# Altium project 28Pins_Project_V1I1.PrjPcb (part 1 of 2)
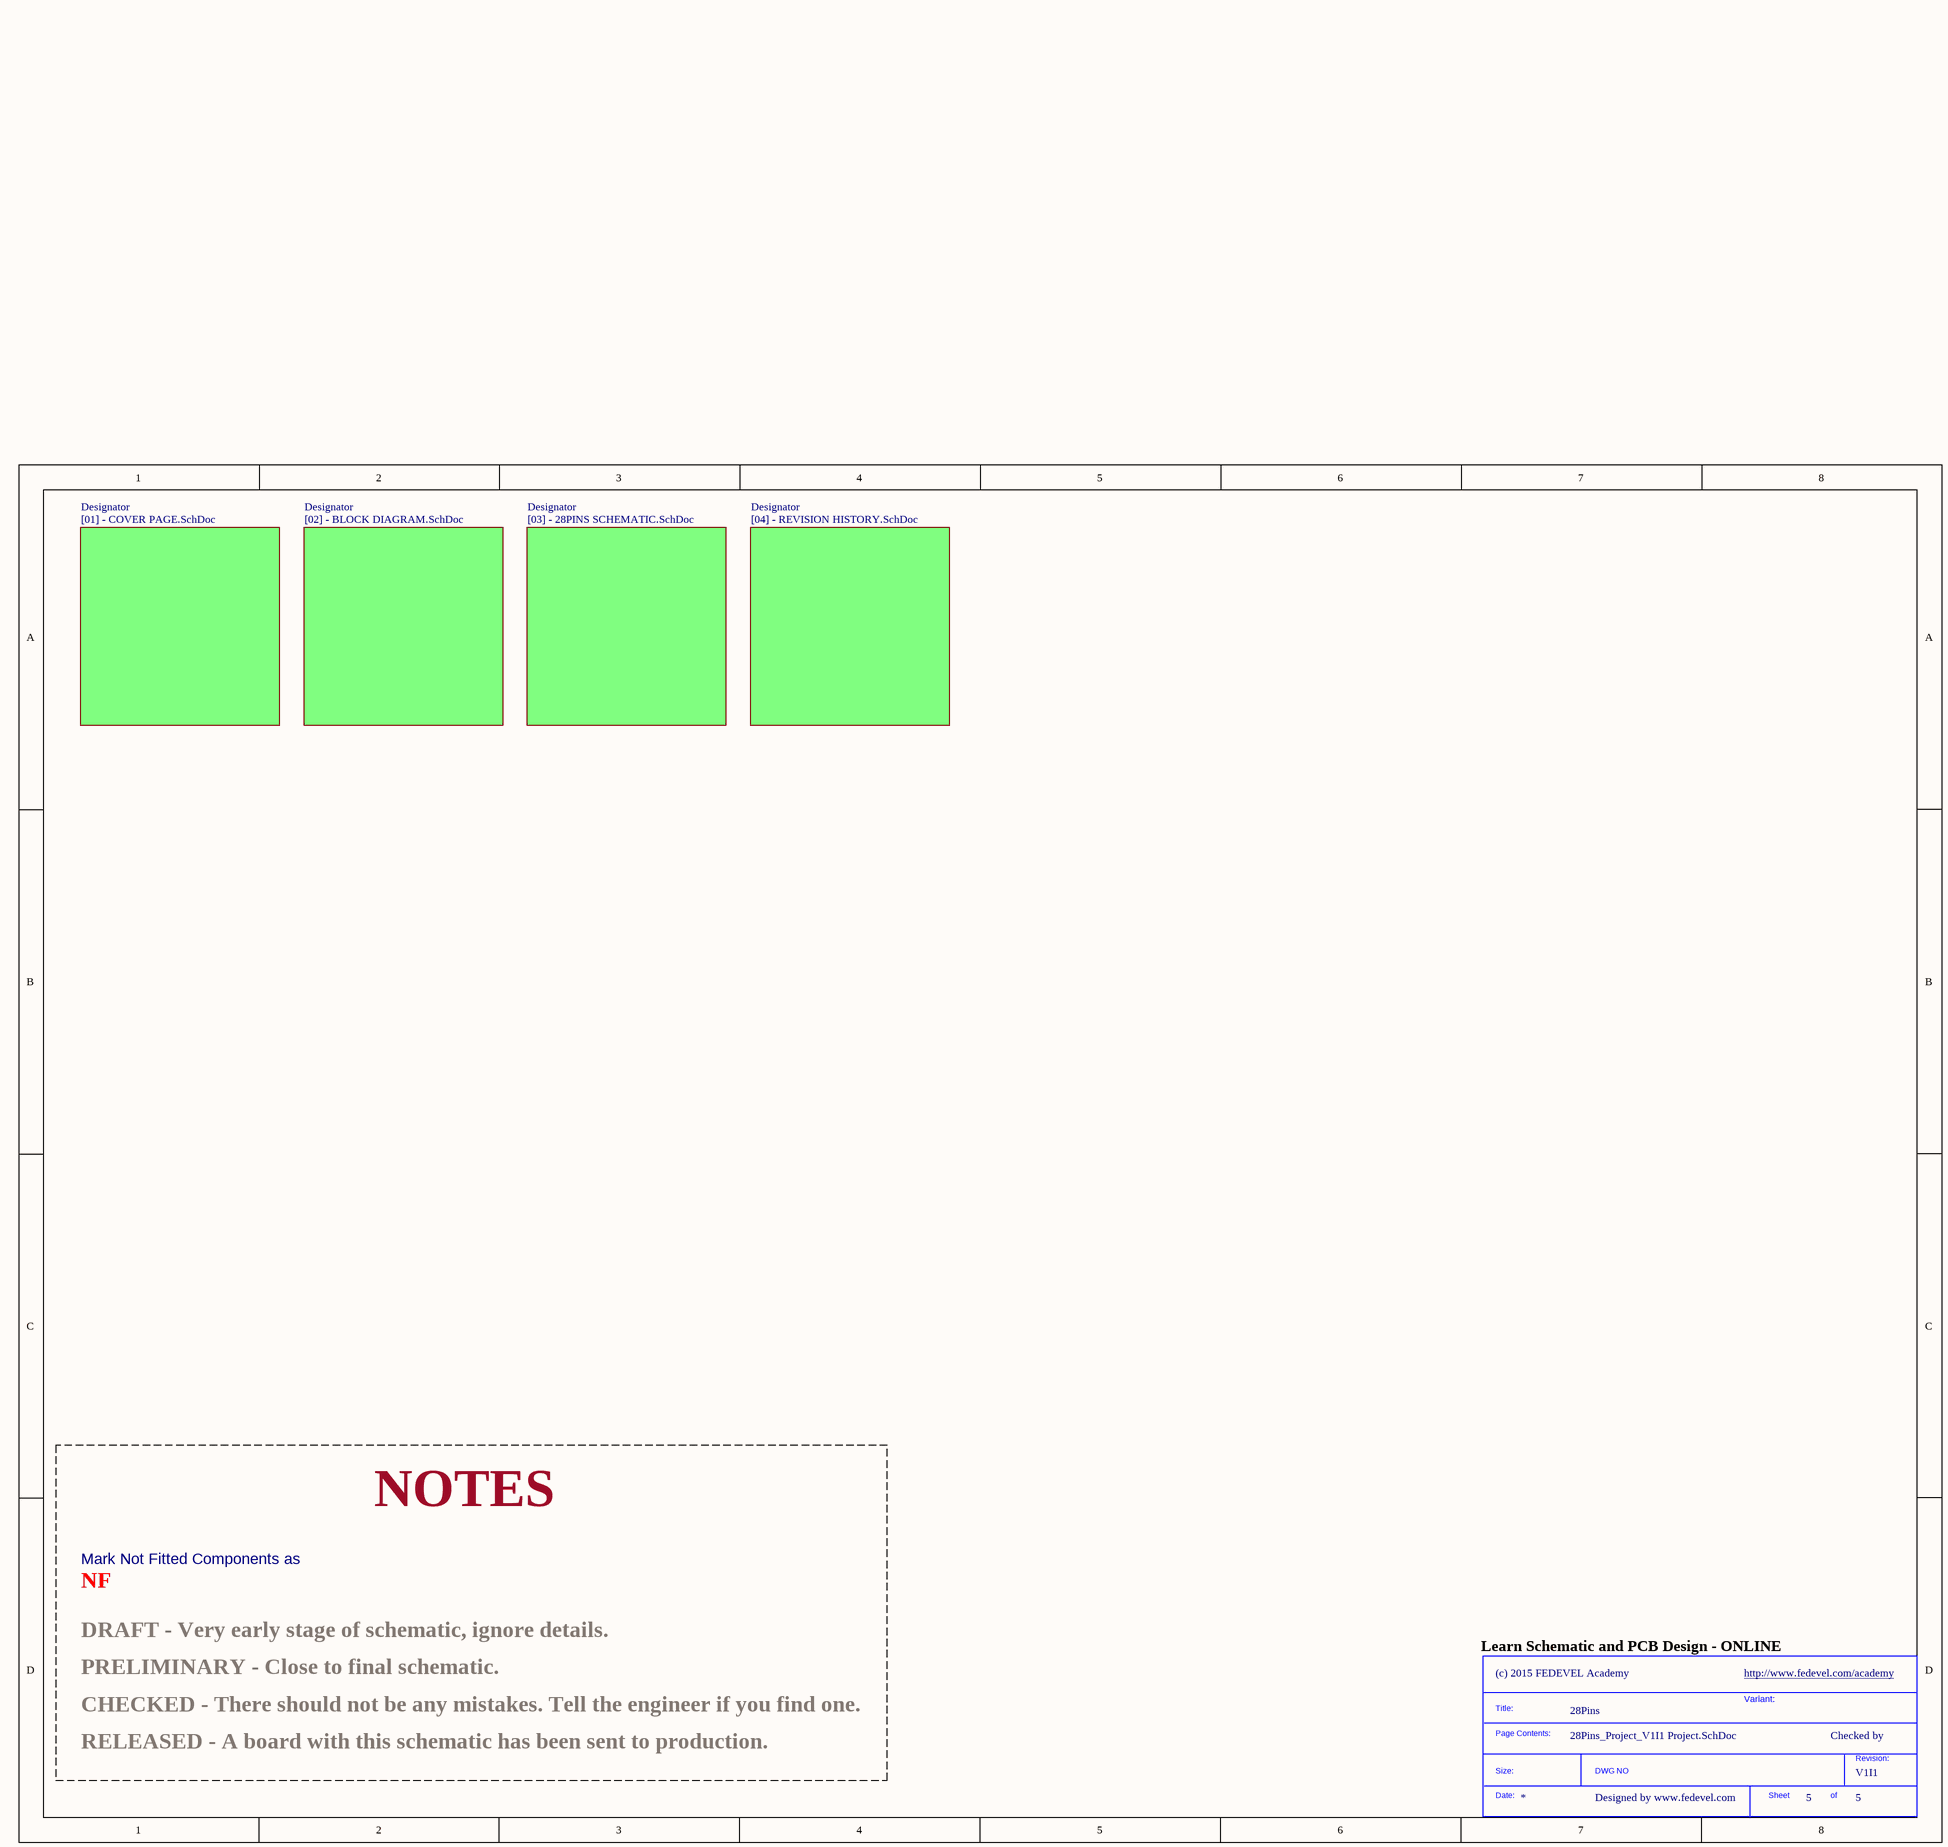
[diagram p0: 28Pins_Project_V1I1 Project.SchDoc]
VersionRevision: V1I1; Project: 28Pins; NotFitted: NF; Company: (c) 2015 FEDEVEL Academy; ClientWebsite: www.fedevel.com; ClientContactName: Robert Feranec; ClientContactEmail: robert.feranec@fedevel.com; ClientCompanyName: FEDEVEL Academy
5 sheets, 114 parts. Net scope: global (net labels, ports and power ports of the same name join across sheets).
Board file: 28Pins_Project_V1I1_PCB.PcbDoc
Sheets:
  28Pins_Project_V1I1 Project.SchDoc
    Designator = [01] - COVER PAGE.SchDoc
    Designator = [02] - BLOCK DIAGRAM.SchDoc
    Designator = [04] - REVISION HISTORY.SchDoc
    Designator = [03] - 28PINS SCHEMATIC.SchDoc

## Sheet 28Pins_Project_V1I1 Project.SchDoc
size A3; DocumentNumber: 5; SheetNumber: 5; SheetTotal: 5; PageSetup: Record=PageOptions|CenterHorizontal=True|CenterVertical=True|PrintScale=1.07|XCorrection=1.00|YCorrection=1.00|PrintKind=1|BorderSize=5000000|LeftOffset=0|BottomOffset=0|Orientation=2|PaperLength=1000|PaperWidth=1000|Scale=100|PaperSource=7|PrintQuality=600|MediaType=1|DitherType=10|PaperKind=A3|PrintScaleMode=1

### Parts
(Parts that share a designator on the sheet are numbered #1, #2 ... from top to bottom, then left to right.)
*#1  SDTitleBlock  (value not drawn)  (graphical)

### Sub-sheets
Designator = [01] - COVER PAGE.SchDoc: no entries
Designator = [02] - BLOCK DIAGRAM.SchDoc: no entries
Designator = [04] - REVISION HISTORY.SchDoc: no entries
Designator = [03] - 28PINS SCHEMATIC.SchDoc: no entries

### Notes on the sheet
- NOTES
- NF
- Mark Not Fitted Components as
- PRELIMINARY - Close to final schematic.
- DRAFT - Very early stage of schematic, ignore details.
- (near *#1) Learn Schematic and PCB Design - ONLINE
- http://www.fedevel.com/academy
- CHECKED - There should not be any mistakes. Tell the engineer if you find one.
- Variant:
- Checked by
- RELEASED - A board with this schematic has been sent to production.
- Designed by www.fedevel.com
- (in symbol SDTitleBlock) Title:; Page Contents:; Revision:; Size:; DWG NO; Date:; Sheet; of

## Sheet [01] - COVER PAGE.SchDoc
size A3; DocumentNumber: 1; SheetNumber: 1; SheetTotal: 5
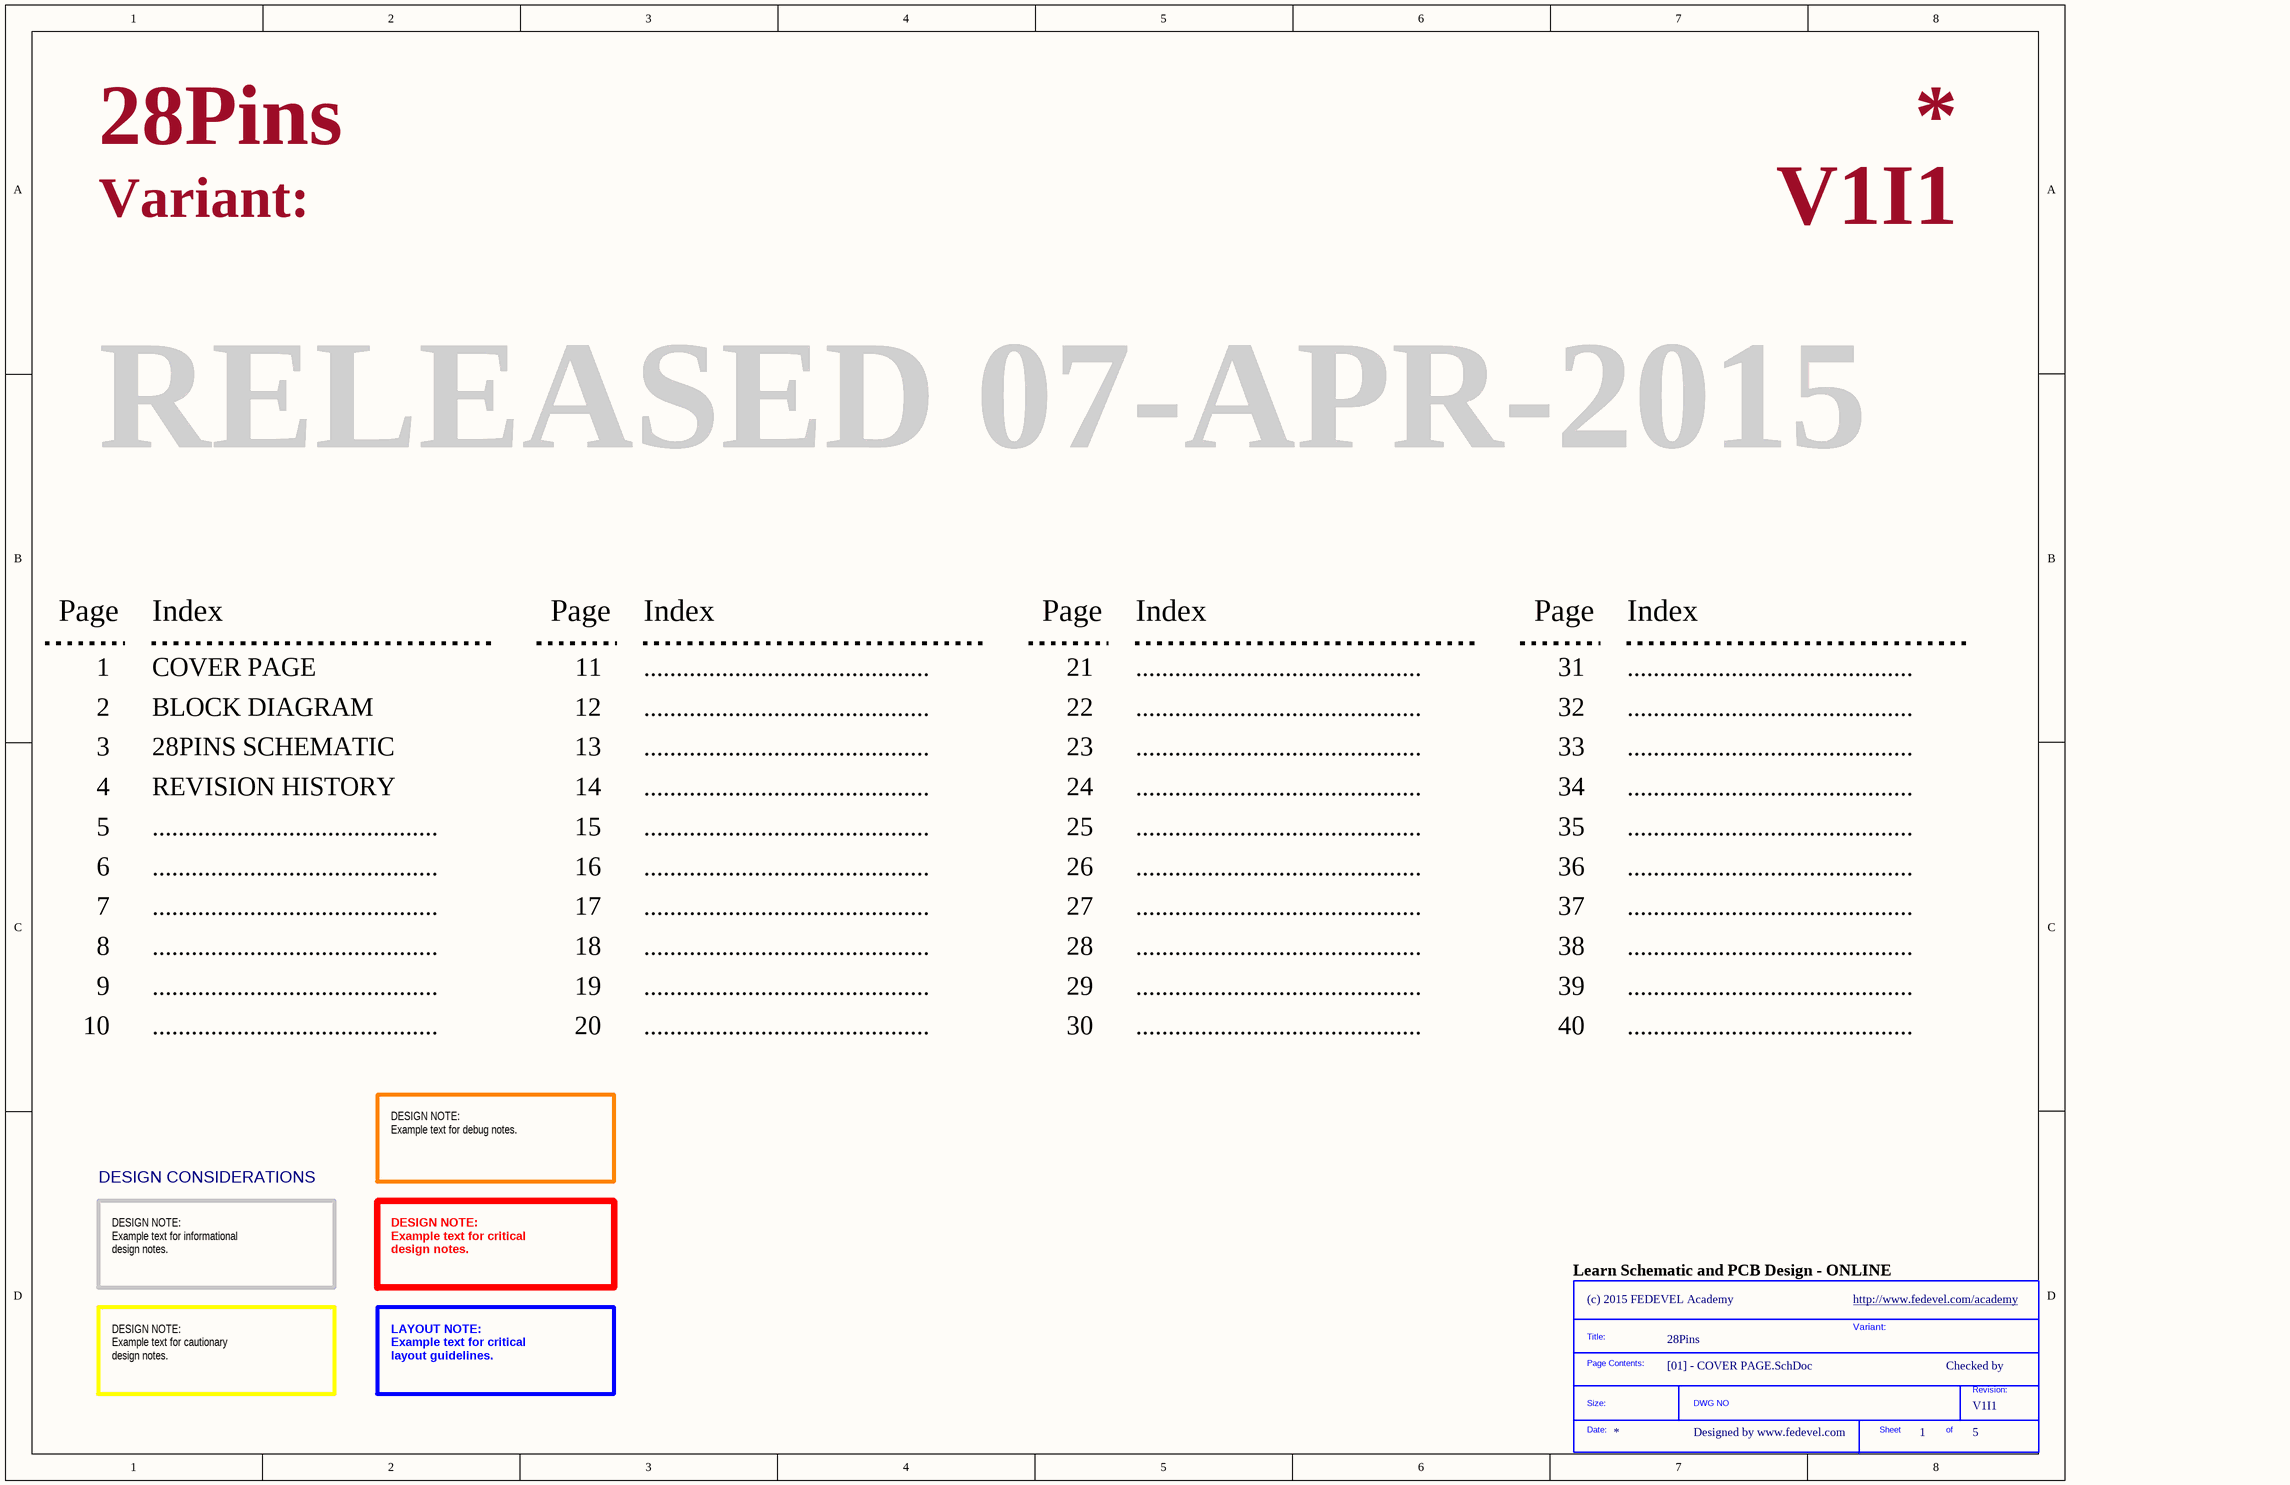
[diagram p1: [01] - COVER PAGE.SchDoc]

### Parts
(Parts that share a designator on the sheet are numbered #1, #2 ... from top to bottom, then left to right.)
*#2  SDTitleBlock  (value not drawn)  (graphical)

### Notes on the sheet
- Variant:
- RELEASED 07-APR-2015
- Page
- Index
- 1
- COVER PAGE
- 11
- ............................................
- 21
- 31
- 2
- 3
- BLOCK DIAGRAM
- 28PINS SCHEMATIC
- 12
- 13
- 22
- 23
- 32
- 33
- 4
- 5
- REVISION HISTORY
- 14
- 15
- 24
- 25
- 34
- 35
- 6
- 16
- 26
- 36
- 7
- 8
- 17
- 18
- 27
- 28
- 37
- 38
- 9
- 10
- 19
- 20
- 29
- 30
- 39
- 40
- DESIGN NOTE:
  Example text for debug notes.
- DESIGN CONSIDERATIONS
- DESIGN NOTE:
  Example text for informational
  design notes.
- DESIGN NOTE:
  Example text for critical
  design notes.
- (near *#2) Learn Schematic and PCB Design - ONLINE
- http://www.fedevel.com/academy
- Checked by
- DESIGN NOTE:
  Example text for cautionary
  design notes.
- LAYOUT NOTE:
  Example text for critical
  layout guidelines.
- Designed by www.fedevel.com
- (in symbol SDTitleBlock) Title:; Page Contents:; Revision:; Size:; DWG NO; Date:; Sheet; of

## Sheet [02] - BLOCK DIAGRAM.SchDoc
size A3; DocumentNumber: 2; SheetNumber: 2; SheetTotal: 5; PageSetup: Record=PageOptions|CenterHorizontal=True|CenterVertical=True|PrintScale=0.52|XCorrection=1.00|YCorrection=1.00|PrintKind=1|BorderSize=5000000|LeftOffset=0|BottomOffset=0|Orientation=2|PaperLength=1000|PaperWidth=1000|Scale=100|PaperSource=4|PrintQuality=600|MediaType=1|DitherType=10|PrintScaleMode=1|PaperKind=A4|PaperIndex=9
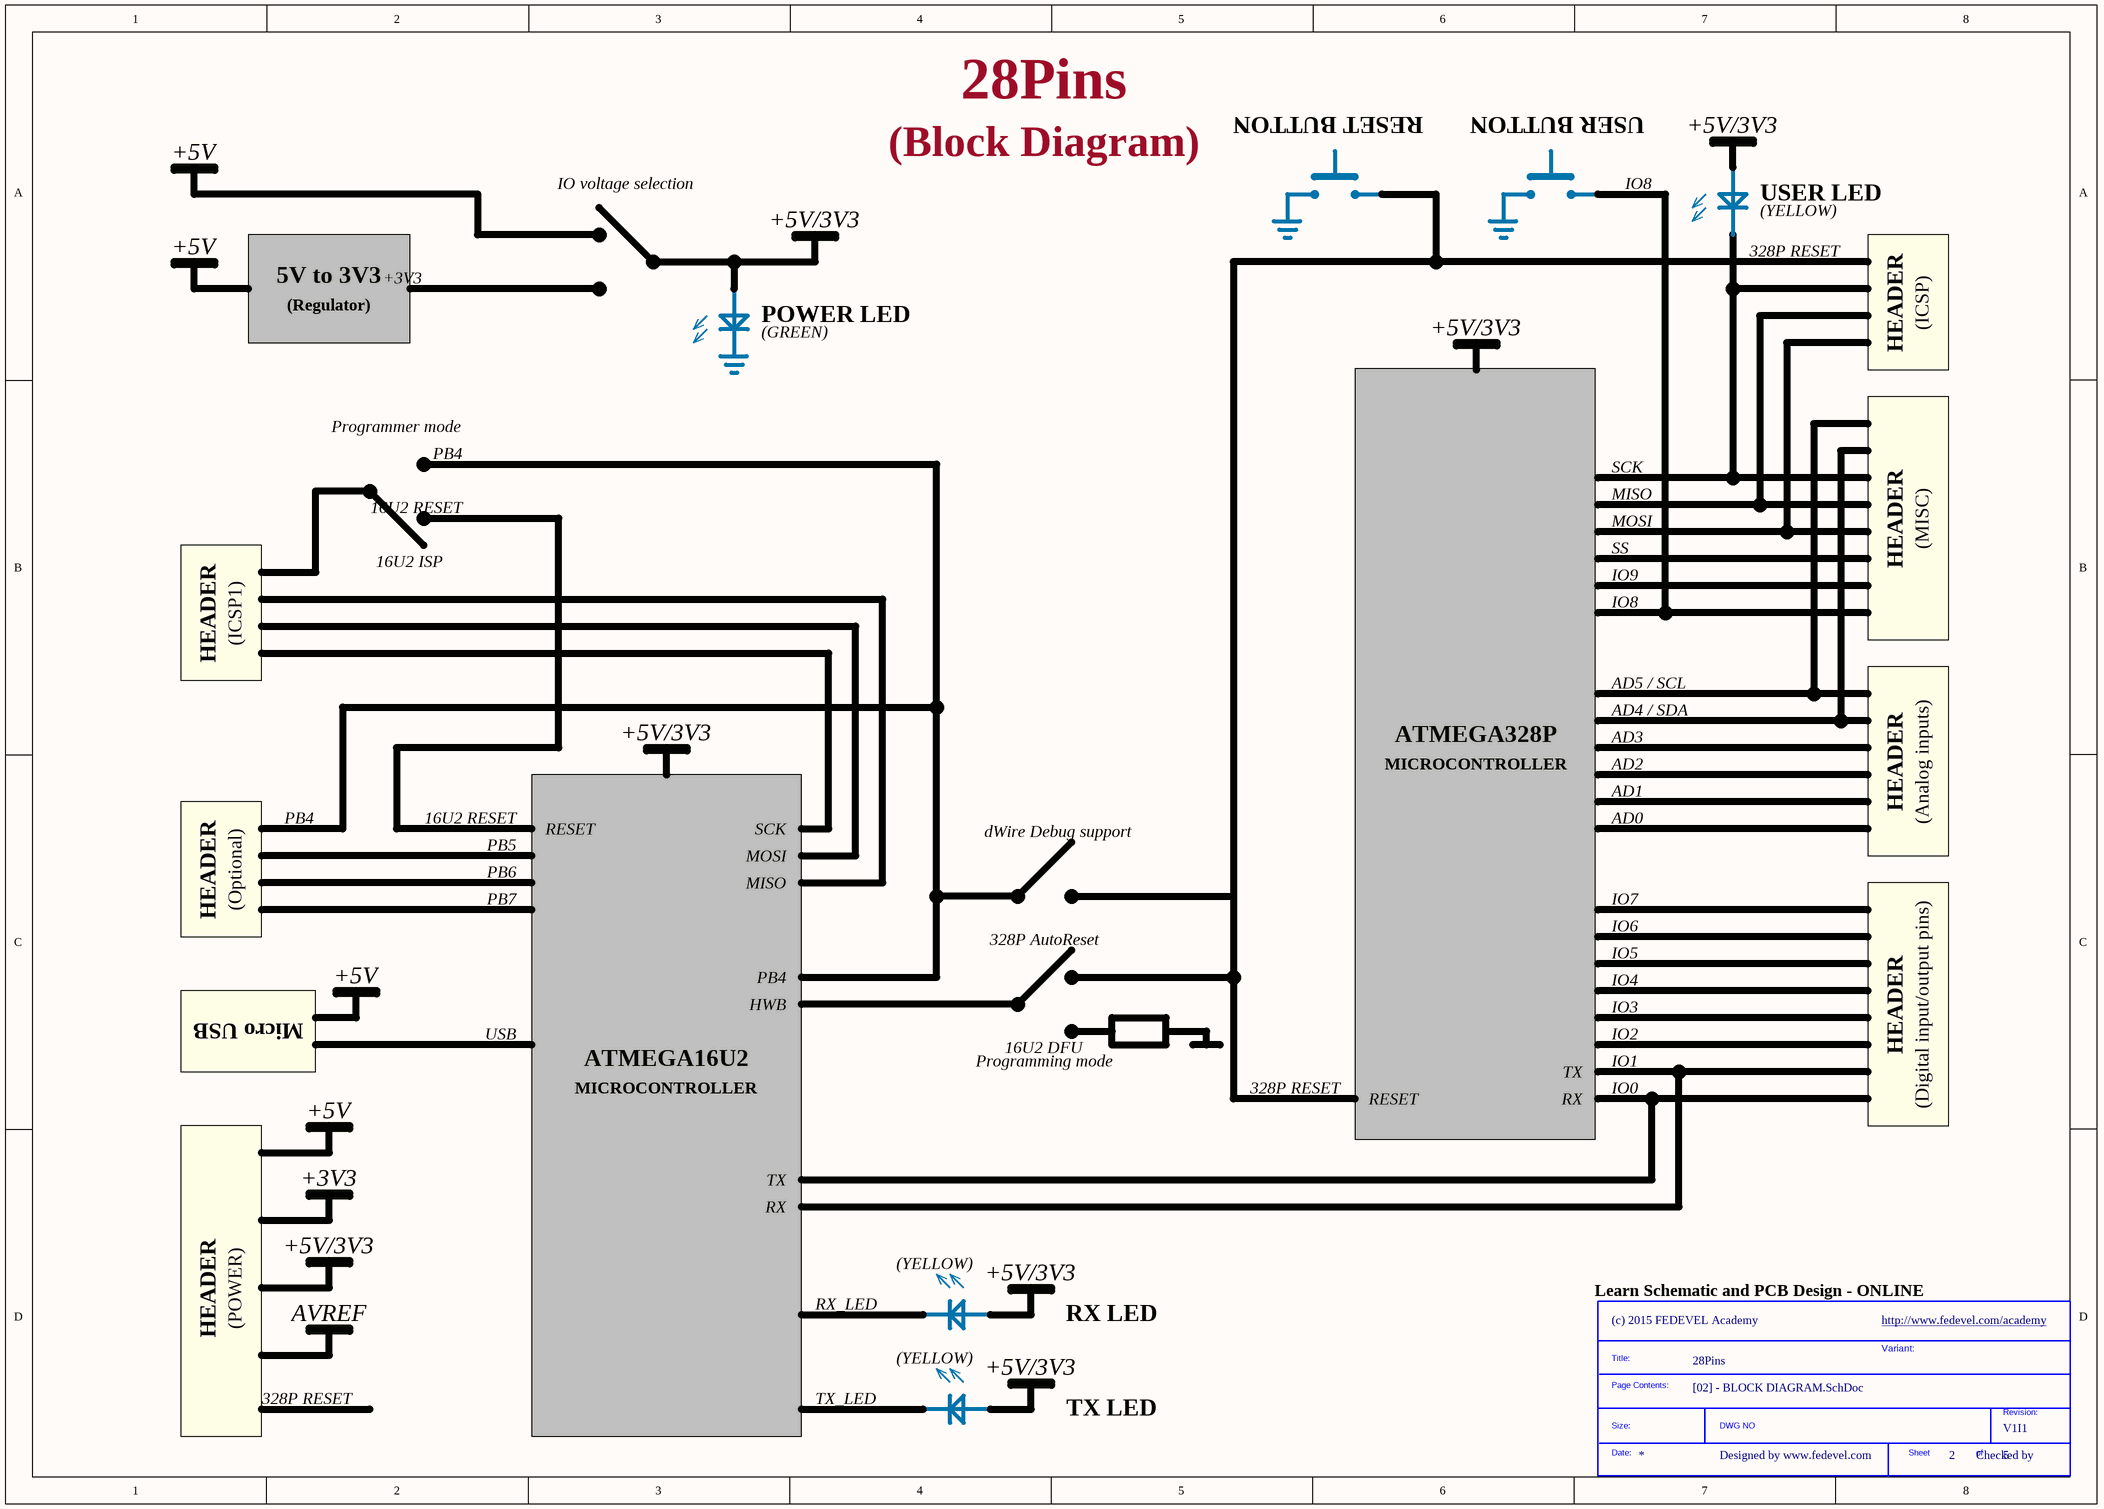
[diagram p2: [02] - BLOCK DIAGRAM.SchDoc]

### Parts
(Parts that share a designator on the sheet are numbered #1, #2 ... from top to bottom, then left to right.)
*#3  SDTitleBlock  (value not drawn)  (graphical)

### Notes on the sheet
- +5V
- (Block Diagram)
- RESET BUTTON
- USER BUTTON
- +5V/3V3
- IO voltage selection
- IO8
- USER LED
- (YELLOW)
- 5V to 3V3
- (Regulator)
- +3V3
- 328P RESET
- HEADER
- (ICSP)
- POWER LED
- (GREEN)
- Programmer mode
- PB4
- 16U2 RESET
- MISO
- SCK
- (MISC)
- 16U2 ISP
- SS
- IO9
- MOSI
- (ICSP1)
- AD5 / SCL
- AD4 / SDA
- ATMEGA328P
- MICROCONTROLLER
- AD3
- AD2
- (Analog inputs)
- PB5
- RESET
- dWire Debug support
- AD1
- AD0
- (Optional)
- PB6
- PB7
- IO7
- 328P AutoReset
- IO6
- IO5
- IO4
- Micro USB
- USB
- ATMEGA16U2
- HWB
- 16U2 DFU
- IO3
- IO2
- (Digital input/output pins)
- Programming mode
- RX
- TX
- IO1
- IO0
- (POWER)
- AVREF
- RX_LED
- RX LED
- (near *#3) Learn Schematic and PCB Design - ONLINE
- http://www.fedevel.com/academy
- Variant:
- TX_LED
- TX LED
- Designed by www.fedevel.com
- Checked by
- (in symbol SDTitleBlock) Title:; Page Contents:; Revision:; Size:; DWG NO; Date:; Sheet; of

## Sheet [04] - REVISION HISTORY.SchDoc
size A3; DocumentNumber: 4; SheetNumber: 4; SheetTotal: 5
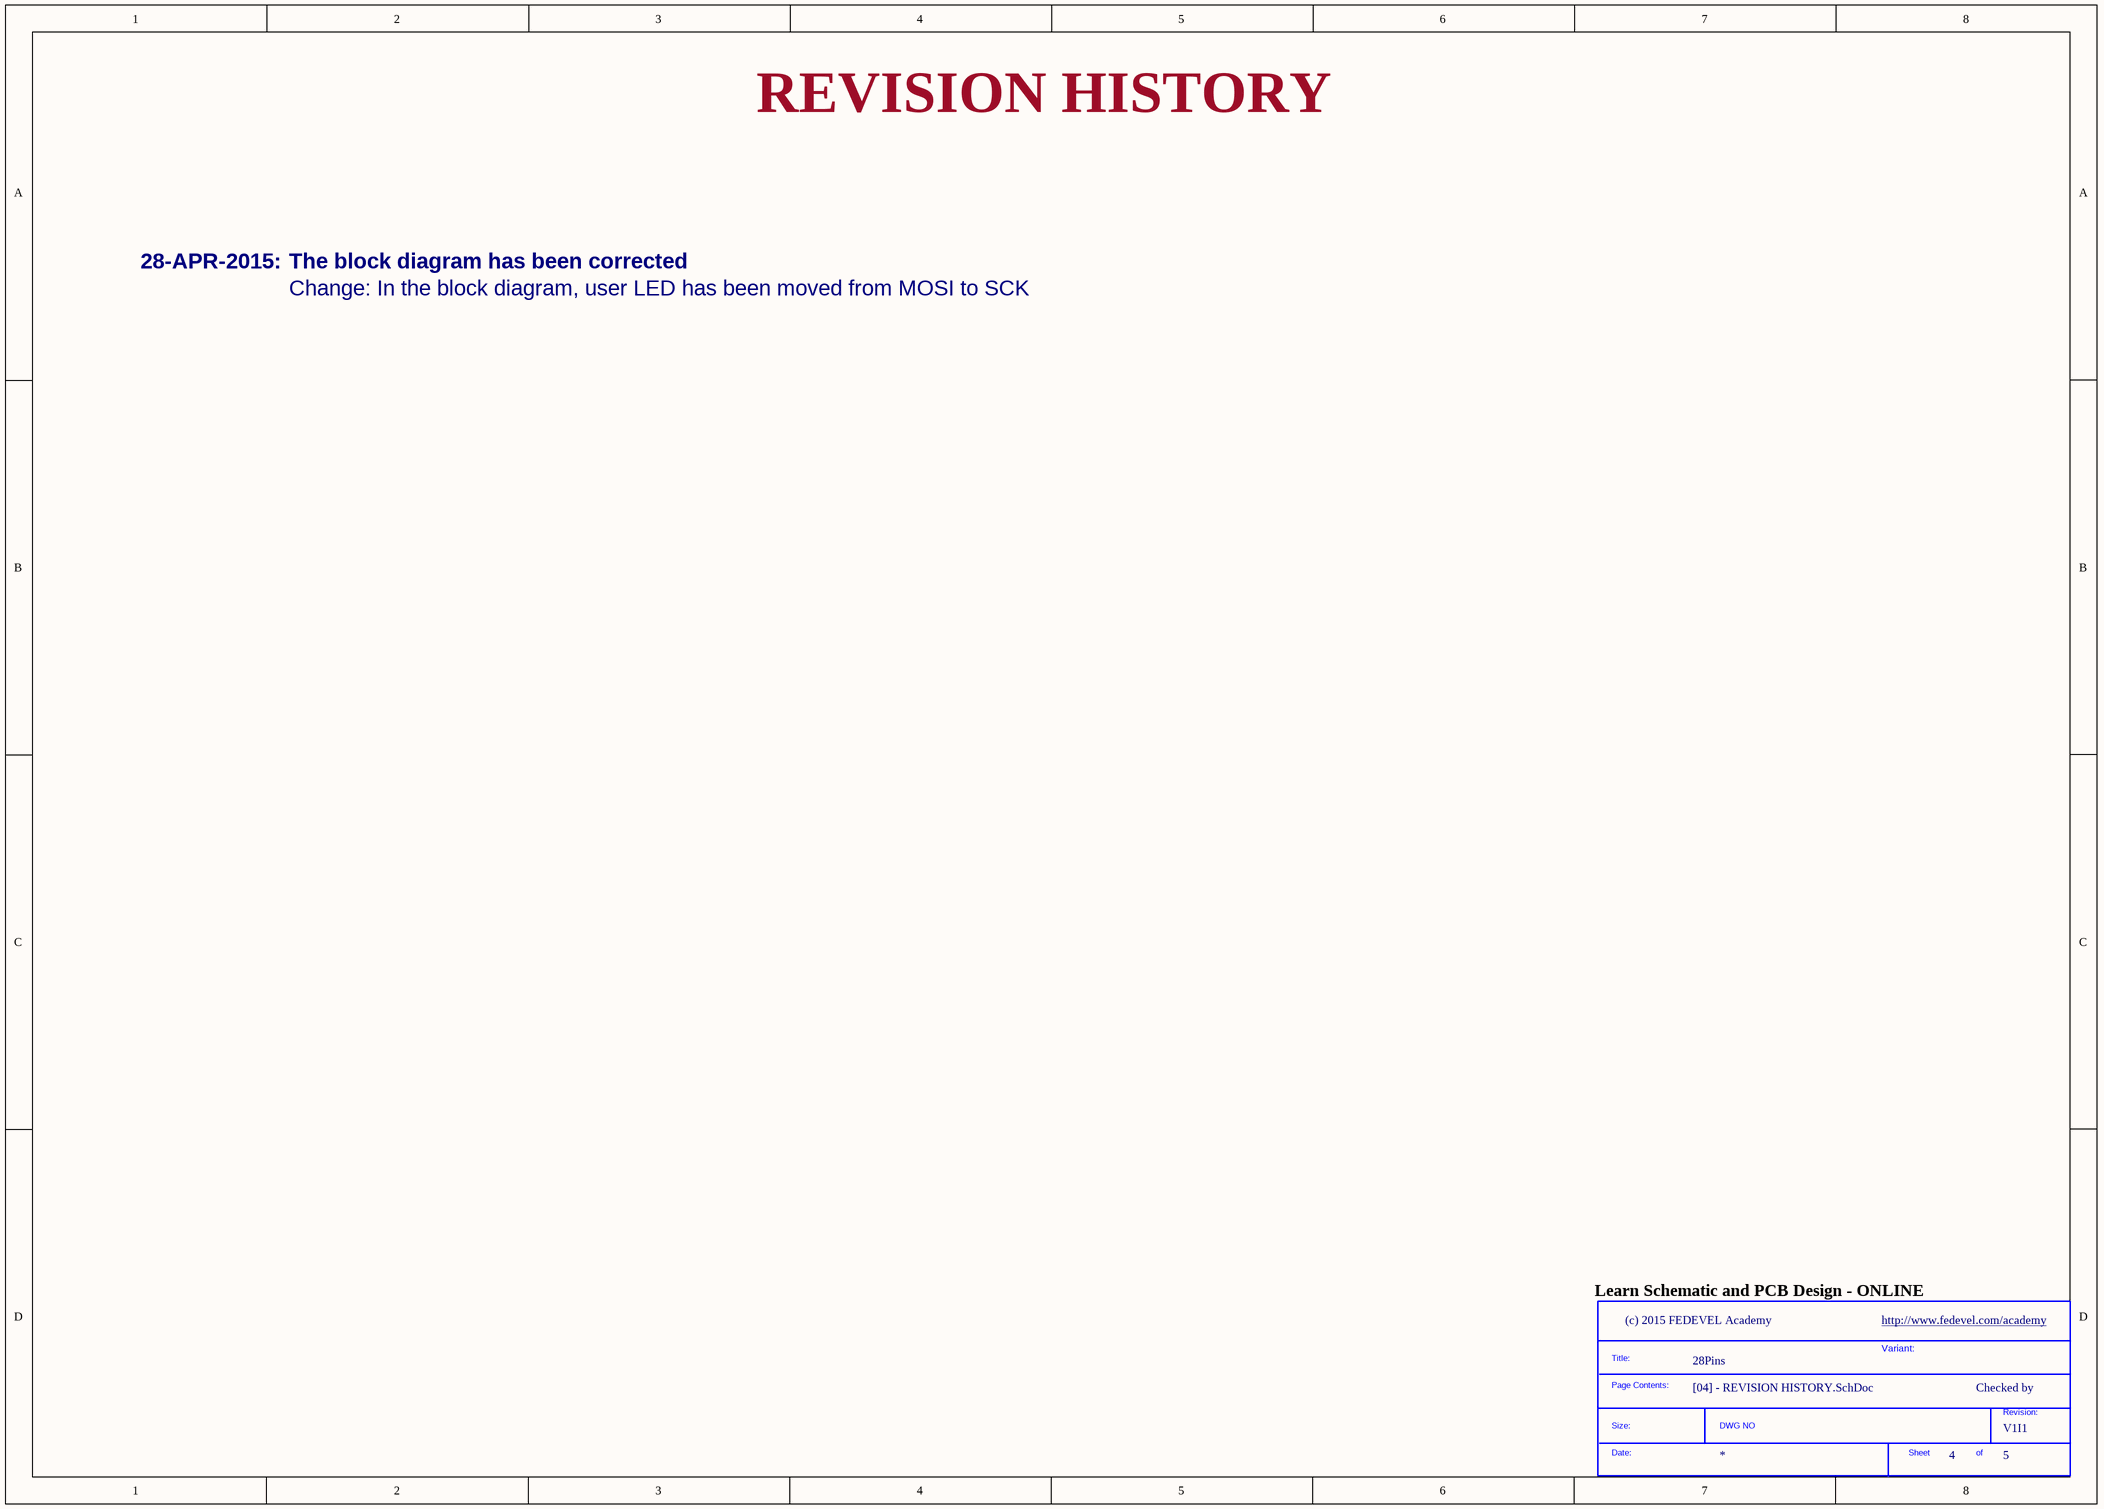
[diagram p3: [04] - REVISION HISTORY.SchDoc]

### Parts
(Parts that share a designator on the sheet are numbered #1, #2 ... from top to bottom, then left to right.)
*#4  SDTitleBlock  (value not drawn)  (graphical)

### Notes on the sheet
- REVISION HISTORY
- 28-APR-2015:
- The block diagram has been corrected
- Change: In the block diagram, user LED has been moved from MOSI to SCK
- (near *#4) Learn Schematic and PCB Design - ONLINE
- http://www.fedevel.com/academy
- Variant:
- Checked by
- (in symbol SDTitleBlock) Title:; Page Contents:; Revision:; Size:; DWG NO; Date:; Sheet; of